# Altium schematic sheet 1_电子天平_MCU.SchDoc: 电子天平_MCU
size A4; Date: 2020/01/07; ApprovedBy: Riggin; CheckedBy: Riggin; Author: Riggin; DrawnBy: Riggin; Engineer: Riggin; DocumentNumber: 2; Revision: V1.0; SheetNumber: 2; SheetTotal: 8; Time: 14:09:34; ProjectName: 电子天平
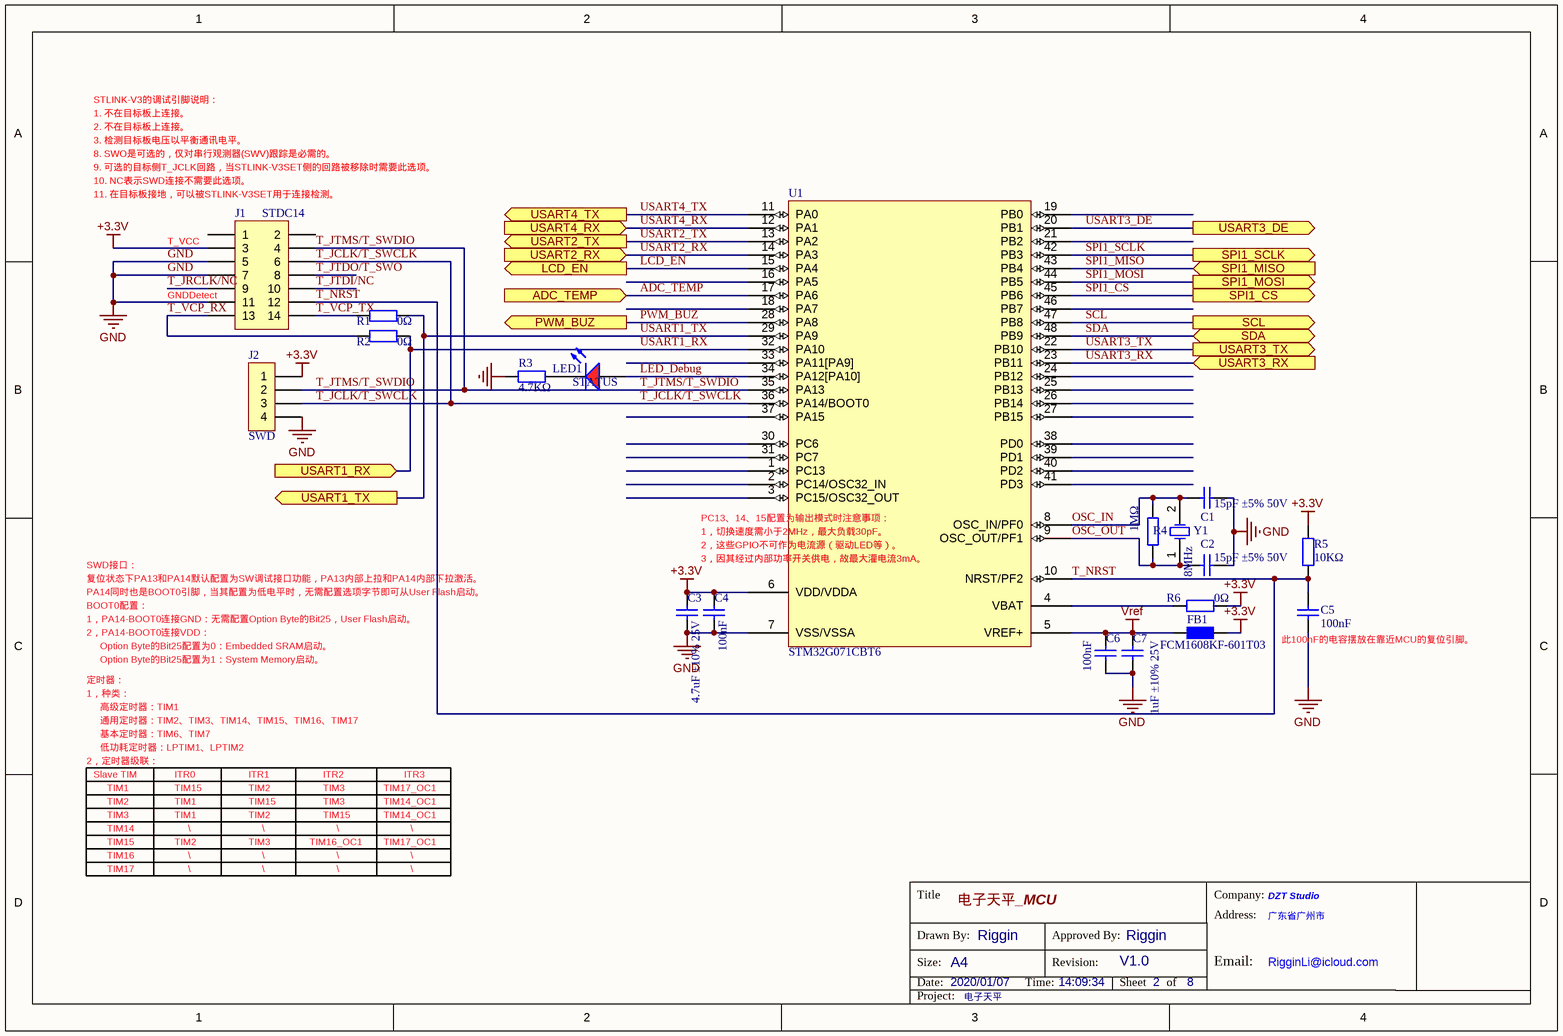
[diagram p0: 1_电子天平_MCU.SchDoc]

## Parts
C1  15pF ±5% 50V  [LC-0805_C]
C2  15pF ±5% 50V  [LC-0805_C]
C3  4.7uF ±10% 25V  [LC-0805_C]
C4  100nF  [LC-0805_C]
C5  100nF  [LC-0805_C]
C6  100nF  [LC-0805_C]
C7  1uF ±10% 25V  [LC-0805_C]
FB1  FCM1608KF-601T03  [LC-0603_L]
J1  STDC14  [CON-FTSH-107-01-L-DV-K]
J2  SWD  [CON-PH2.0-4P-DIP]
LED1  STATUS  [LC-0805_LED_S1]
R1  0Ω  [LC-0805_R]
R2  0Ω  [LC-0805_R]
R3  4.7KΩ  [LC-0805_R]
R4  1MΩ  [LC-0805_R]
R5  10KΩ  [LC-0805_R]
R6  0Ω  [LC-0805_R]
U1  STM32G071CBT6  [LC-LQFP-48_7x7x05P]
Y1  8MHz  [3225_XT_2P]

## Ports
ADC_TEMP (in), LCD_EN (out), PWM_BUZ (out), SCL (out), SDA (bidir), SPI1_CS (out), SPI1_MISO (in), SPI1_MOSI (out), SPI1_SCLK (out), USART1_RX (in), USART1_TX (out), USART2_RX (in), USART2_TX (out), USART3_DE (out), USART3_RX (in), USART3_TX (out), USART4_RX (in), USART4_TX (out)

## Nets
+3.3V: C3.1 C4.1 FB1.1 J1.3 J2.1 R5.2 R6.1 U1.6(VDD/VDDA)
GND: C1.1 C2.1 C3.2 C4.2 C5.2 C6.2 C7.2 J1.5 J1.7 J1.11 J2.4 R3.2 U1.7(VSS/VSSA)
Vref: C6.1 C7.1 FB1.2 U1.5(VREF+)
ADC_TEMP: U1.17(PA6) ; port ADC_TEMP
LCD_EN: U1.15(PA4) ; port LCD_EN
LED_Debug: LED1.A U1.34(PA12[PA10])
OSC_IN: C1.2 R4.2 U1.8(OSC_IN/PF0) Y1.2(OSC2)
OSC_OUT: C2.2 R4.1 U1.9(OSC_OUT/PF1) Y1.1(OSC1)
PWM_BUZ: U1.28(PA8) ; port PWM_BUZ
SCL: U1.47(PB8) ; port SCL
SDA: U1.48(PB9) ; port SDA
SPI1_CS: U1.45(PB6) ; port SPI1_CS
SPI1_MISO: U1.43(PB4) ; port SPI1_MISO
SPI1_MOSI: U1.44(PB5) ; port SPI1_MOSI
SPI1_SCLK: U1.42(PB3) ; port SPI1_SCLK
T_JCLK/T_SWCLK: J1.6 J2.3 U1.36(PA14/BOOT0)
T_JRCLK/NC: J1.9
T_JTDI/NC: J1.10
T_JTDO/T_SWO: J1.8
T_JTMS/T_SWDIO: J1.4 J2.2 U1.35(PA13)
T_NRST: C5.1 J1.12 R5.1 U1.10(NRST/PF2)
T_VCP_RX: J1.13 R2.2
T_VCP_TX: J1.14 R1.2
USART1_RX: R2.1 U1.32(PA10) ; port USART1_RX
USART1_TX: R1.1 U1.29(PA9) ; port USART1_TX
USART2_RX: U1.14(PA3) ; port USART2_RX
USART2_TX: U1.13(PA2) ; port USART2_TX
USART3_DE: U1.20(PB1) ; port USART3_DE
USART3_RX: U1.23(PB11) ; port USART3_RX
USART3_TX: U1.22(PB10) ; port USART3_TX
USART4_RX: U1.12(PA1) ; port USART4_RX
USART4_TX: U1.11(PA0) ; port USART4_TX
NetLED1_K: LED1.K R3.1
NetR6_2: R6.2 U1.4(VBAT)

Not connected (* = marked no-connect by the designer): J1 1 2; U1 1(PC13) 2(PC14/OSC32_IN) 3(PC15/OSC32_OUT) 16(PA5) 18(PA7) 19(PB0) 21(PB2) 24(PB12) 25(PB13) 26(PB14) 27(PB15) 30(PC6) 31(PC7) 33(PA11[PA9]) 37(PA15) 38(PD0) 39(PD1) 40(PD2) 41(PD3) 46(PB7)

## Notes on the sheet
- 1. 不在目标板上连接。
- STLINK-V3的调试引脚说明：
- 3. 检测目标板电压以平衡通讯电平。
- 8. SWO是可选的，仅对串行观测器(SWV)跟踪是必需的。
- 9. 可选的目标侧T_JCLK回路，当STLINK-V3SET侧的回路被移除时需要此选项。
- 2. 不在目标板上连接。
- 10. NC表示SWD连接不需要此选项。
- (near J1) 11. 在目标板接地，可以被STLINK-V3SET用于连接检测。
- (near J1) T_VCC
- (near J1) GNDDetect
- (near U1) PC13、14、15配置为输出模式时注意事项：
- 复位状态下PA13和PA14默认配置为SW调试接口功能，PA13内部上拉和PA14内部下拉激活。
- SWD接口：
- (near U1) 1，切换速度需小于2MHz，最大负载30pF。
- (near U1) 2，这些GPIO不可作为电流源（驱动LED等）。
- (near U1) 3，因其经过内部功率开关供电，故最大灌电流3mA。
- BOOT0配置：
- 1，PA14-BOOT0连接GND：无需配置Option Byte的Bit25，User Flash启动。
- 2，PA14-BOOT0连接VDD：
- PA14同时也是BOOT0引脚，当其配置为低电平时，无需配置选项字节即可从User Flash启动。
- Option Byte的Bit25配置为0：Embedded SRAM启动。
- (near C5) 此100nF的电容摆放在靠近MCU的复位引脚。
- 定时器：
- 1，种类：
- Option Byte的Bit25配置为1：System Memory启动。
- 高级定时器：TIM1
- 2，定时器级联：
- Slave TIM
- 通用定时器：TIM2、TIM3、TIM14、TIM15、TIM16、TIM17
- 基本定时器：TIM6、TIM7
- 低功耗定时器：LPTIM1、LPTIM2
- TIM1
- ITR0
- TIM15
- ITR1
- TIM2
- ITR2
- TIM3
- TIM17_OC1
- ITR3
- TIM14
- \
- TIM16_OC1
- TIM14_OC1
- TIM16
- TIM17
- Title
- Company:
- Address:
- 广东省广州市
- DZT Studio
- Size:
- Date:
- Drawn By:
- A4
- Riggin
- Time:
- Revision:
- Approved By:
- Sheet
- of
- Email:
- RigginLi@icloud.com
- Project:

## Library data of the parts
C1 C2 = Cap: MLCC NP0; Value: 100pF; Published: 8-Jun-2000; LatestRevisionDate: 17-Jul-2002; LatestRevisionNote: Re-released for DXP Platform.; PackageReference: RAD-0.3; Publisher: Altium Limited; PackageDescription: Radial Cap, Thru-Hole; 2 Leads; 0.3 in Pin Spacing
C3-C7 = Cap: MLCC; Value: 100pF; Published: 8-Jun-2000; LatestRevisionDate: 17-Jul-2002; LatestRevisionNote: Re-released for DXP Platform.; PackageReference: RAD-0.3; Publisher: Altium Limited; PackageDescription: Radial Cap, Thru-Hole; 2 Leads; 0.3 in Pin Spacing
FB1 = FB: 磁珠
J1 = Header 7X2: Header, 7-Pin, Dual row; LatestRevisionDate: 17-Jul-2002; LatestRevisionNote: Re-released for DXP Platform.; Publisher: Altium Limited
J2 = SIP4
LED1 = 0603: LED; ComponentLink1URL: http://www.szlcsc.com/product/details_2659.html; Package: 0603; Supplier: LC; SuppliersPartNumber: C2286
R1-R6 = Res2: Resistor; Value: 1K; Published: 8-Jun-2000; LatestRevisionDate: 17-Jul-2002; LatestRevisionNote: Re-released for DXP Platform.; PackageReference: AXIAL-0.4; Publisher: Altium Limited; PackageDescription: Axial Device, Thru-Hole; 2 Leads; 0.4 in Pin Spacing
U1 = STM32G081CBT6: 128KB Flash, 36KB RAM, 4USART,timers,ADC,DAC,comm. I/Fs,AES-256,1.65-3.6V
Y1 = SMD-5032_2P 8MHz 20ppm 2: SMD 8MHz; ComponentLink1URL: http://www.szlcsc.com/product/details_19261.html; Package: SMD-5032_2P; Supplier: LC; SuppliersPartNumber: C18560